# Altium schematic sheet JacdacEc30xlTemplate20x20 133.SchDoc: Complete design
size A4; DocumentNumber: 1; SheetNumber: 1; SheetTotal: 1; VersionControl_RevNumber: 1
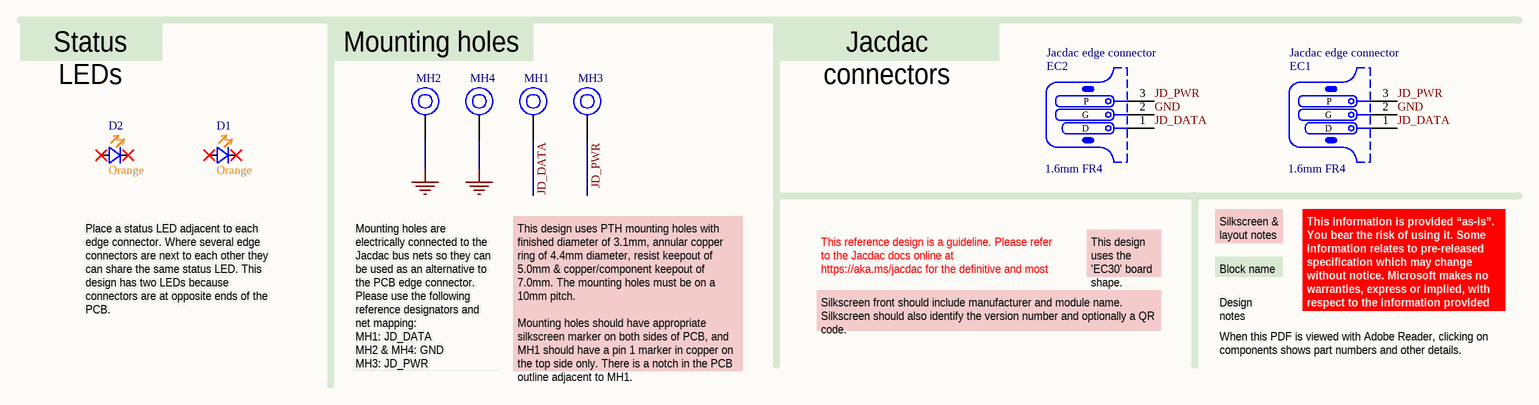
[diagram p0: JacdacEc30xlTemplate20x20 133.SchDoc]

## Parts
D1  Colour: Orange  [0603 Orange]  (hidden comment: 19-217/S2C-AQ1R1B/3T)
D2  Colour: Orange  [0603 Orange]  (hidden comment: 19-217/S2C-AQ1R1B/3T)
EC1  Jacdac edge connector  PCB Type: 1.6mm FR4  [JACDAC_EDGE_CONNECTOR_NO_TRACES]  (no BOM)
EC2  Jacdac edge connector  PCB Type: 1.6mm FR4  [JACDAC_EDGE_CONNECTOR_NO_TRACES]  (no BOM)
MH1  MH_6.5MMK_4.5MMC_3.0MMD_PTH  [MH_6.5MMK_4.5MMC_3.0MMD_PTH]  (value not drawn)  (no BOM)
MH2  MH_6.5MMK_4.5MMC_3.0MMD_PTH  [MH_6.5MMK_4.5MMC_3.0MMD_PTH]  (value not drawn)  (no BOM)
MH3  MH_6.5MMK_4.5MMC_3.0MMD_PTH  [MH_6.5MMK_4.5MMC_3.0MMD_PTH]  (value not drawn)  (no BOM)
MH4  MH_6.5MMK_4.5MMC_3.0MMD_PTH  [MH_6.5MMK_4.5MMC_3.0MMD_PTH]  (value not drawn)  (no BOM)

## Nets
GND: EC1.2(G) EC2.2(G) MH2.1 MH4.1
JD_DATA: EC1.1(D) EC2.1(D) MH1.1
JD_PWR: EC1.3(P) EC2.3(P) MH3.1

Not connected (* = marked no-connect by the designer): D1 1(K)* 2(A)*; D2 1(K)* 2(A)*

## Notes on the sheet
- Status LEDs
- Mounting holes
- Jacdac connectors
- This reference design is a guideline. Please refer to the Jacdac docs online at https://aka.ms/jacdac for the definitive and most up-to-date information.
- This design uses the 'EC30' board shape.
- Block name
- Silkscreen & layout notes
- Place a status LED adjacent to each edge connector. Where several edge connectors are next to each other they can share the same status LED. This design has two LEDs because connectors are at opposite ends of the PCB.
- Mounting holes are electrically connected to the Jacdac bus nets so they can be used as an alternative to the PCB edge connector. Please use the following reference designators and net mapping:
- Silkscreen front should include manufacturer and module name. Silkscreen should also identify the version number and optionally a QR code.
- Design notes
- When this PDF is viewed with Adobe Reader, clicking on components shows part numbers and other details.
- This information is provided “as-is”. You bear the risk of using it. Some information relates to pre-released specification which may change without notice. Microsoft makes no warranties, express or implied, with respect to the information provided here.
- MH1: JD_DATA
  MH2 & MH4: GND
  MH3: JD_PWR
- This design uses PTH mounting holes with finished diameter of 3.1mm, annular copper ring of 4.4mm diameter, resist keepout of 5.0mm & copper/component keepout of 7.0mm. The mounting holes must be on a 10mm pitch.
  Mounting holes should have appropriate silkscreen marker on both sides of PCB, and MH1 should have a pin 1 marker in copper on the top side only. There is a notch in the PCB outline adjacent to MH1.
- PROJECT FILENAME
- PROJECT CODENAME
- Microsoft
- PROJECT DESCRIPTION
- SHEET DESCRIPTION
- SHEET FILENAME
- LICENCE
- LAST MODIFIED
- PAGE
- OF
- DRAWN BY
- REVISION
- PCB ID

## Library data of the parts
D1 D2 = 19-217/S2C-AQ1R1B/3T: LED ORANGE DIFFUSED 0603 SMD; Manufacturer: Everlight Elec; Manufacturer Part Number: 19-217/S2C-AQ1R1B/3T; Mount: Surface Mount; Case/Package: 0603; Color: Orange; Case Code (Imperial): 0603; ComponentLink1URL: https://datasheet.lcsc.com/lcsc/1912171731_Everlight-Elec-19-217-S2C-AQ1R1B-3T_C146215.pdf; ComponentLink1Description: Online datasheet; Supplier 1: LCSC; Supplier 1 Part Number: C146215
EC1 EC2 = Jacdac edge connector: 3 pin Jacdac edge connector 1.27mm pitch; Manufacturer Part Number: JACDAC_EDGE_CONNECTOR; Checked By: ?; Created By: D. Gakure; ComponentLink1Description: Yuliang JACDAC cable connector drawing online; ComponentLink1URL: https://github.com/microsoft/jacdac-mdk/blob/main/connector/JACDAC-Connector-by-Yuliang-2020-11-28.pdf; ComponentLink2Description: JACDAC PCB edge connector spec onlin; ComponentLink2URL: https://github.com/microsoft/jacdac-mdk/blob/main/connector/JACDAC_PCB_Edge_Connector_Drawing_JD-PEC-01_rev_01.pdf
MH1-MH4 = MH_6.5MMK_4.5MMC_3.0MMD_PTH: Mounting Hole 6.5mm keepout, 4.5mm annualar ring and 3.0mm Drill PTH